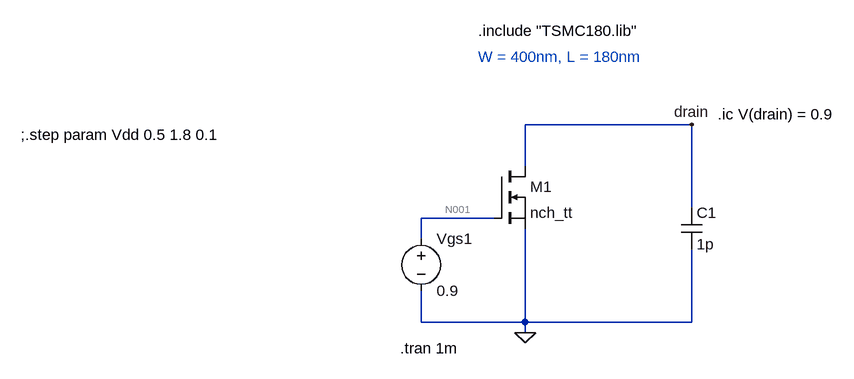
[diagram p0: schematic Q1_nmos_400_180.asc]
Q1_nmos_400_180.asc, the LTspice schematic file:
Version 4
SHEET 1 896 680
WIRE 640 80 384 80
WIRE 384 144 384 80
WIRE 640 208 640 80
WIRE 336 224 224 224
WIRE 224 256 224 224
WIRE 224 384 224 336
WIRE 384 384 384 240
WIRE 384 384 224 384
WIRE 640 384 640 272
WIRE 640 384 384 384
WIRE 384 400 384 384
FLAG 384 400 0
FLAG 640 80 drain
SYMBOL nmos 336 144 R0
SYMATTR InstName M1
SYMATTR Value nch_tt
SYMATTR Value2 W=400n L=180n
SYMBOL voltage 224 240 R0
WINDOW 123 0 0 Left 0
WINDOW 39 0 0 Left 0
SYMATTR InstName Vgs1
SYMATTR Value 0.9
SYMBOL cap 624 208 R0
SYMATTR InstName C1
SYMATTR Value 1p
TEXT 312 -64 Left 2 !.include "TSMC180.lib"
TEXT 312 -24 Left 2 ;W = 400nm, L = 180nm
TEXT 680 64 Left 2 !.ic V(drain) = 0.9
TEXT 192 424 Left 2 !.tran 1m
TEXT -392 96 Left 2 !;.step param Vdd 0.5 1.8 0.1

The netlist it stands for:
* Q1_nmos_400_180.asc
M1 drain N001 0 0 nch_tt W=400n L=180n
Vgs1 N001 0 0.9
C1 drain 0 1p
.model NMOS NMOS
.model PMOS PMOS
.lib standard.mos
.include "TSMC180.lib"
* W = 400nm, L = 180nm
.ic V(drain) = 0.9
.tran 1m
;.step param Vdd 0.5 1.8 0.1
.backanno
.end

* Results of the author's LTspice run, read from the files saved beside the schematic
* Operating Point, zero values left out:
*   V(drain) = 900 mV
*   V(n001) = 900 mV
*   Id(M1) = 57.83 µA
*   Is(M1) = -57.83 µA
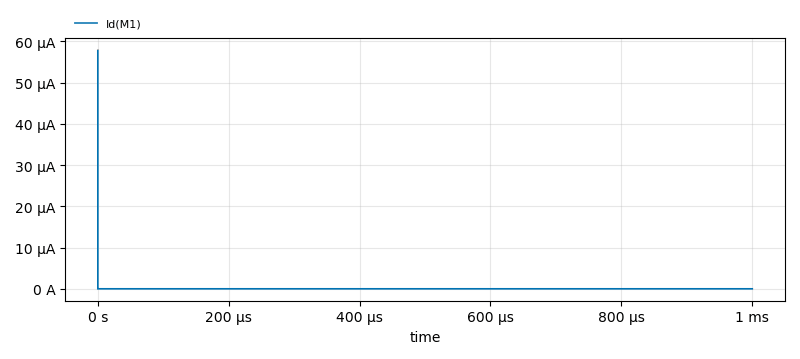
[diagram p1: Transient Analysis of Q1_nmos_400_180.asc, plotted from the saved traces]
* Transient Analysis, 1 run:
*   Id(M1): min 0 A, max 57.83 µA, average 992.8 pA, rms 202.9 nA, last 0 A